# Altium project HAB_Schematic.PrjPcb
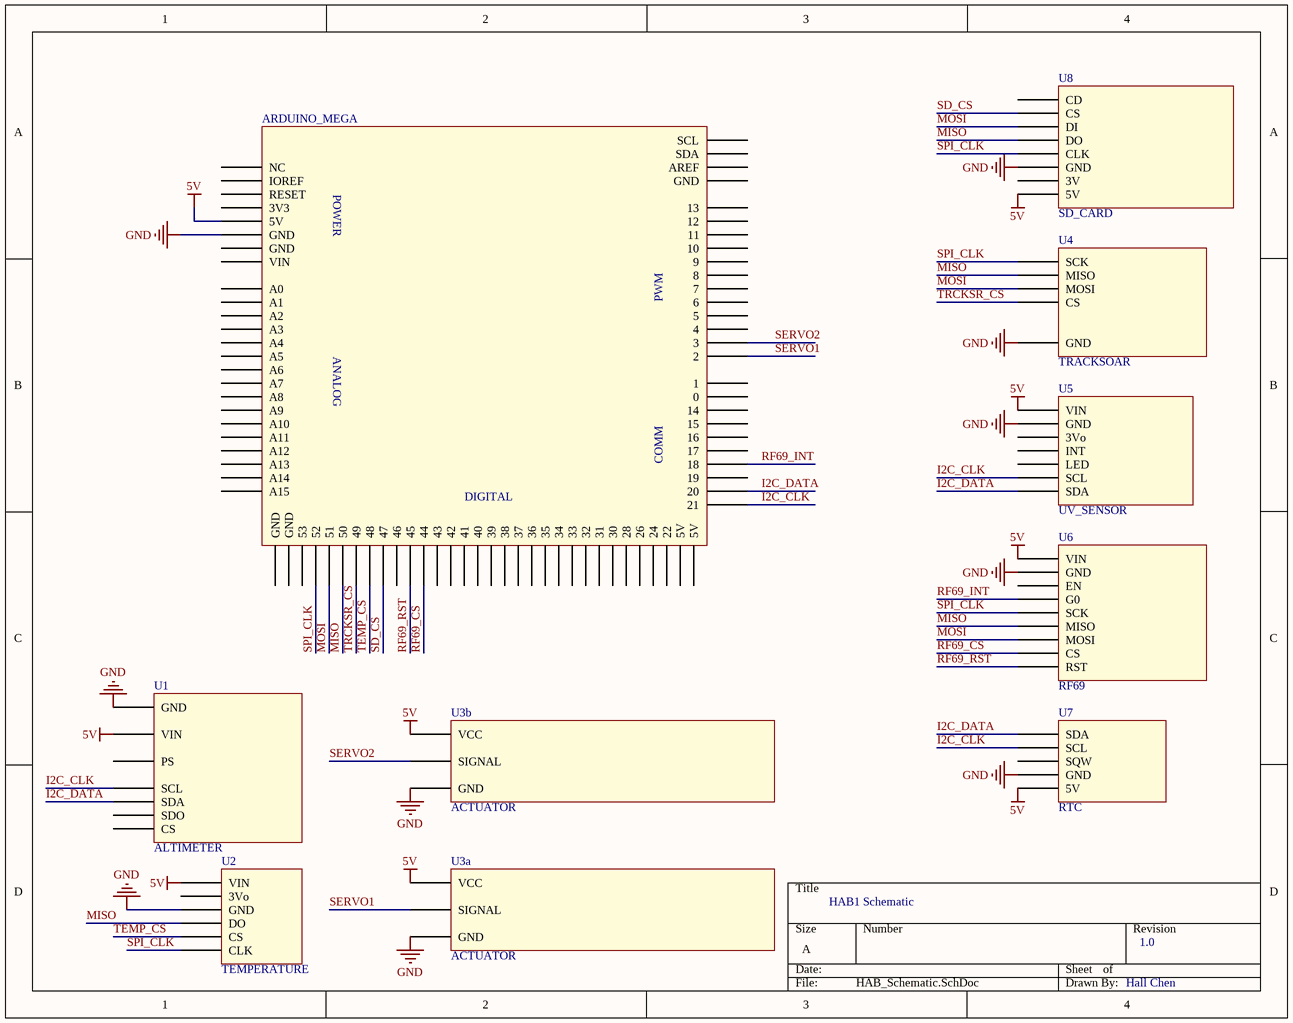
[diagram p0: HAB_Schematic.SchDoc]
1 sheet, 10 parts. Net scope: global (net labels, ports and power ports of the same name join across sheets).

## Sheet HAB_Schematic.SchDoc
size A

### Parts
ARDUINO_MEGA  ARDUINO_MEGA  (value not drawn)
U1  ALTIMETER
U2  TEMPERATURE
U3a  ACTUATOR
U3b  ACTUATOR
U4  TRACKSOAR
U5  UV_SENSOR
U6  RF69
U7  RTC
U8  SD_CARD

### Nets
5V: ARDUINO_MEGA.5(5V) U1.2(VIN) U2.1(VIN) U3a.0(VCC) U3b.0(VCC) U5.1(VIN) U6.1(VIN) U7.5(5V) U8.8(5V)
GND: ARDUINO_MEGA.6(GND) U1.1(GND) U2.3(GND) U3a.2(GND) U3b.2(GND) U4.5(GND) U5.2(GND) U6.2(GND) U7.4(GND) U8.6(GND)
I2C_CLK: ARDUINO_MEGA.73(21) U1.4(SCL) U5.6(SCL) U7.2(SCL)
I2C_DATA: ARDUINO_MEGA.72(20) U1.5(SDA) U5.7(SDA) U7.1(SDA)
MISO: ARDUINO_MEGA.39(50) U2.4(DO) U4.1(MISO) U6.6(MISO) U8.4(DO)
MOSI: ARDUINO_MEGA.40(51) U4.2(MOSI) U6.7(MOSI) U8.3(DI)
RF69_CS: ARDUINO_MEGA.33(44) U6.8(CS)
RF69_INT: ARDUINO_MEGA.70(18) U6.4(G0)
RF69_RST: ARDUINO_MEGA.34(45) U6.9(RST)
SD_CS: ARDUINO_MEGA.36(47) U8.2(CS)
SERVO1: ARDUINO_MEGA.50(2) U3a.1(SIGNAL)
SERVO2: ARDUINO_MEGA.51(3) U3b.1(SIGNAL)
SPI_CLK: ARDUINO_MEGA.41(52) U2.6(CLK) U4.4(SCK) U6.5(SCK) U8.5(CLK)
TEMP_CS: ARDUINO_MEGA.37(48) U2.5(CS)
TRCKSR_CS: ARDUINO_MEGA.38(49) U4.3(CS)

Not connected (* = marked no-connect by the designer): ARDUINO_MEGA 1(NC) 2(IOREF) 3(RESET) 4(3V3) 7(GND) 8(VIN) 9(A0) 10(A1) 11(A11) 12(A12) 13(A13) 14(A14) 15(A15) 16(GND) 17(GND) 18(53) 19(30) 20(31) 21(32) 22(33) 23(34) 24(35) 25(36) 26(37) 27(38) 28(39) 29(40) 30(41) 31(42) 32(43) 35(46) 42(28) 43(26) 44(24) 45(22) 46(5V) 47(5V) 48(0) 49(1) 52(4) 53(5) 54(6) 55(7) 56(8) 57(9) 58(10) 59(11) 60(12) 61(13) 62(GND) 63(AREF) 64(SDA) 65(SCL) 66(14) 67(15) 68(16) 69(17) 71(19); U1 3(PS) 6(SDO) 7(CS); U2 2(3Vo); U5 3(3Vo) 4(INT) 5(LED); U6 3(EN); U7 3(SQW); U8 1(CD) 7(3V)

### Notes on the sheet
- HAB1 Schematic
- 1.0
- Hall Chen
- (in symbol ARDUINO_MEGA) POWER; PWM; ANALOG; COMM; DIGITAL